# EAGLE schematic powerSupplyModule (EAGLE 6.3)
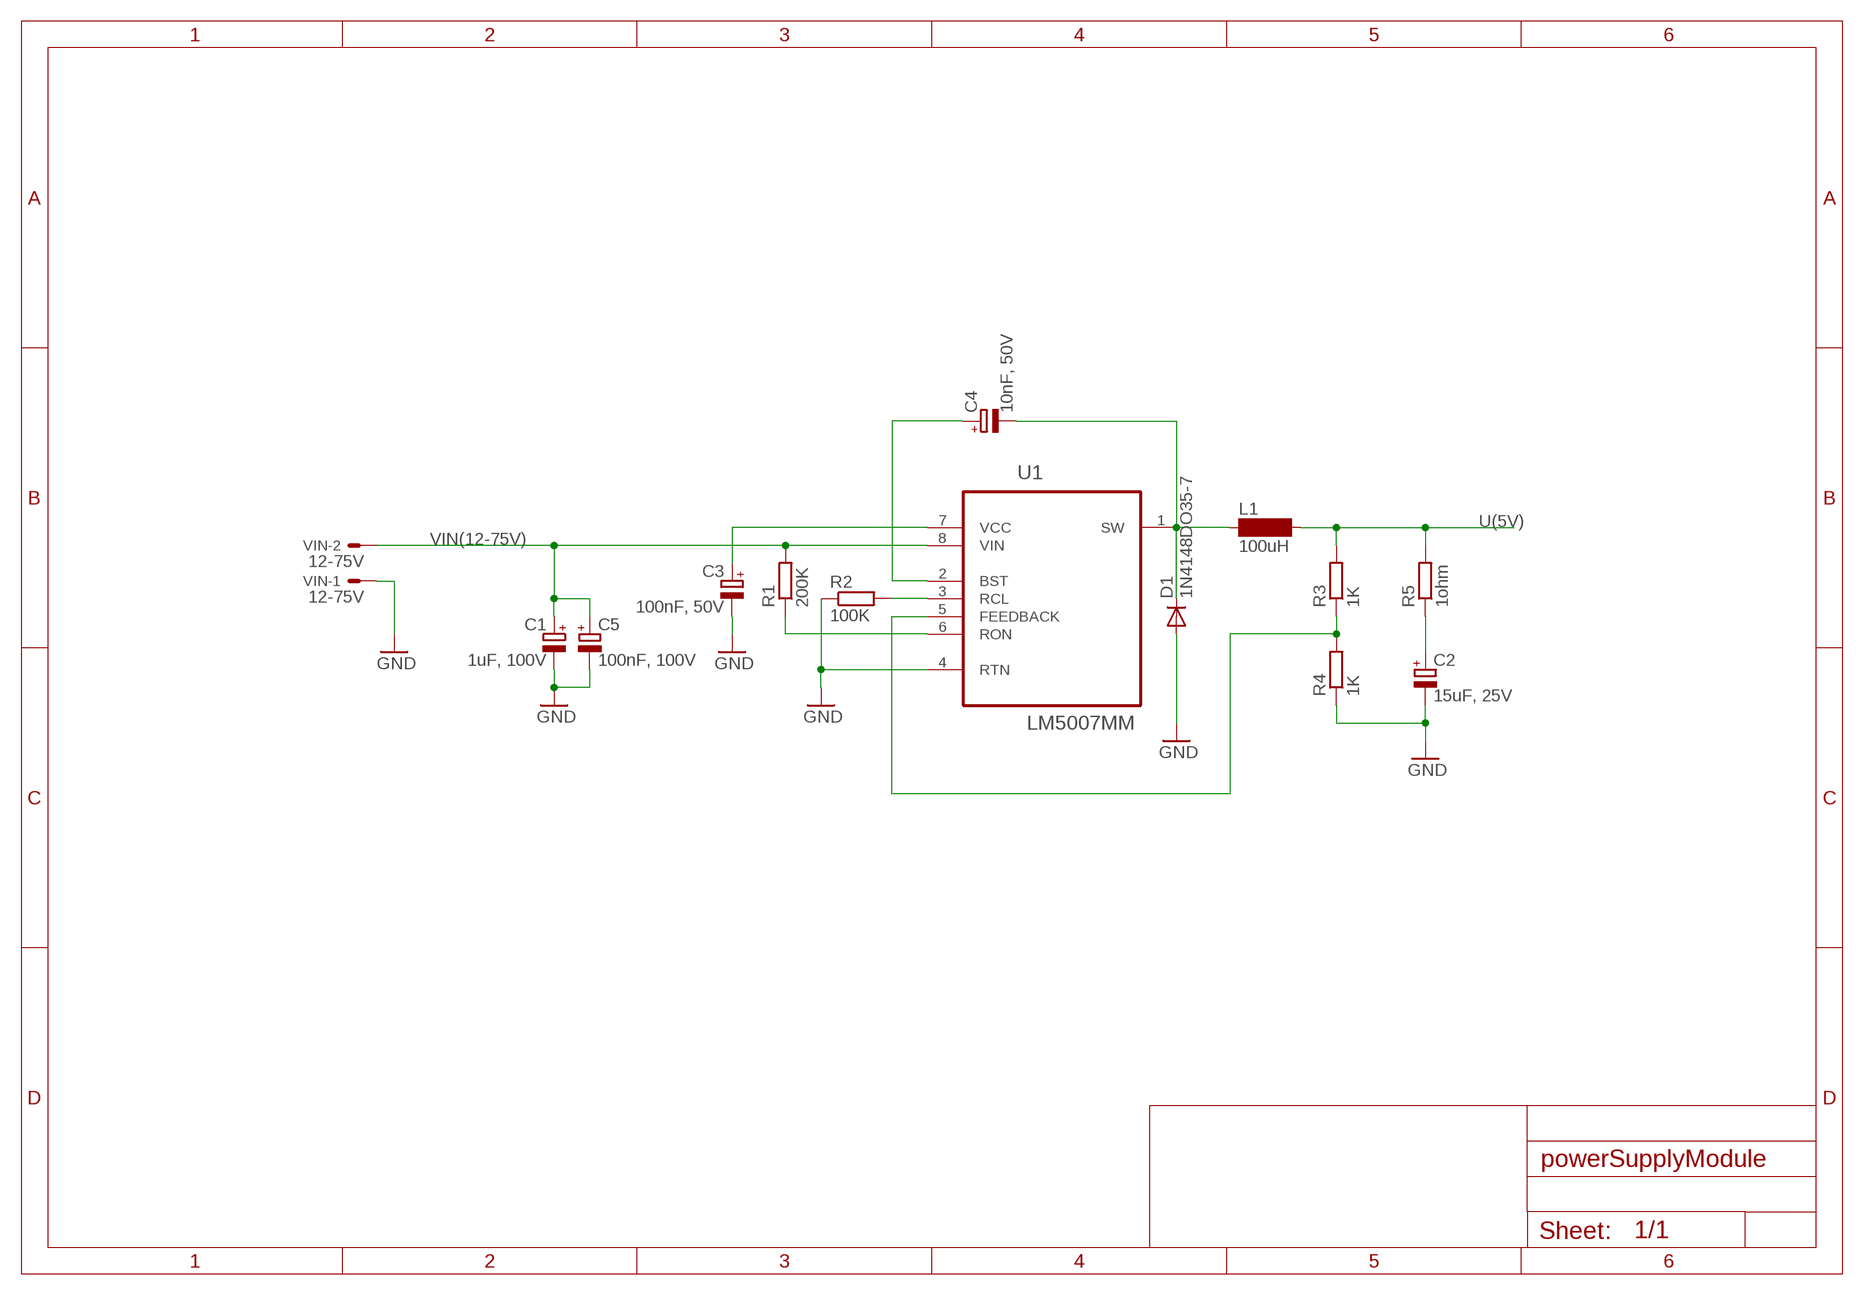
[diagram p0: schematic, sheet 1]

## Parts
C1  1uF, 100V  CPOL-EU153CLV-0405  [153CLV-0405]
C2  15uF, 25V  CPOL-EUC  [PANASONIC_C]
C3  100nF, 50V  CPOL-EUSMCA  [SMC_A]
C4  10nF, 50V  CPOL-EUR/2012-12W  [R/2012-12W]
C5  100nF, 100V  CPOL-EUSMCA  [SMC_A]
D1  1N4148DO35-7  [DO35-7]
L1  100uH  SM-Z15  [SM-Z15]
R1  200K  R-EU_R2010  [R2010]
R2  100K  R-EU_R2010  [R2010]
R3  1K  R-EU_R2010  [R2010]
R4  1K  R-EU_R2010  [R2010]
R5  1ohm  R-EU_R2010  [R2010]
U1  LM5007MM  [SOP65P490X109-8N]
VIN  12-75V  5566-2  [5566-2]

## Nets
GND: C1.- C2.- C3.- C5.- D1.A R2.1 R4.1 U1.4(RTN) VIN.1
N$1: R2.2 U1.3(RCL)
N$3: R1.1 U1.6(RON)
N$5: C4.+ U1.2(BST)
N$6: C4.- D1.C L1.1 U1.1(SW)
N$7: C3.+ U1.7(VCC)
N$8: R3.1 R4.2 U1.5(FEEDBACK)
N$9: C2.+ R5.1
U(5V): L1.2 R3.2 R5.2
VIN(12-75V): C1.+ C5.+ R1.2 U1.8(VIN) VIN.2

## Library data of the parts
C1-C5 = resistor:CPOL-EU: POLARIZED CAPACITOR, European symbol
D1 = diode:1N4148: DIODE high speed (Philips)
L1 = inductor-neosid:SM-Z15: INDUCTOR SMD rod core choke; OC_FARNELL: unknown; OC_NEWARK: unknown
R1-R5 = rcl:R-EU_: RESISTOR, European symbol
U1 = LM5007:LM5007MM: Step-Down Switching Regulator; MPN: LM5007MM; OC_FARNELL: 9779345; OC_NEWARK: 97K3542; PACKAGE: SOP-8; SUPPLIER: TEXAS INSTRUMENTS
VIN = con-molex:5566-2: Mini FIT connector 2 pol Source: http://www.molex.com; OC_FARNELL: 1822072; OC_NEWARK: unknown